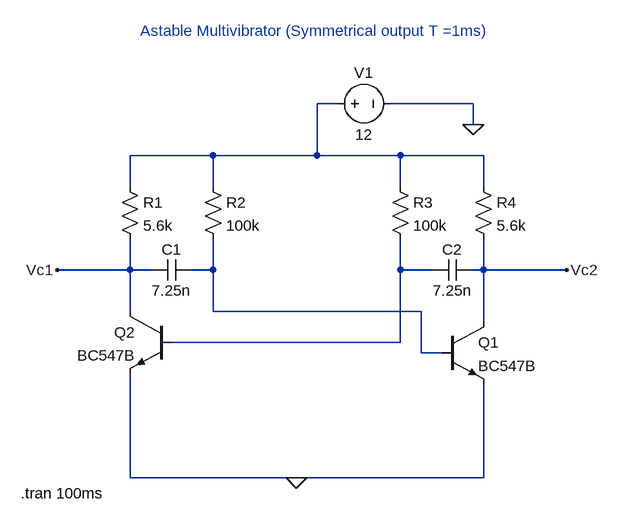
[diagram p0: schematic am1.asc]
am1.asc, the LTspice schematic file:
Version 4
SHEET 1 880 680
WIRE 400 -48 368 -48
WIRE 608 -48 480 -48
WIRE 608 -16 608 -48
WIRE 208 32 80 32
WIRE 368 32 368 -48
WIRE 368 32 208 32
WIRE 496 32 368 32
WIRE 624 32 496 32
WIRE 80 80 80 32
WIRE 208 80 208 32
WIRE 496 80 496 32
WIRE 624 80 624 32
WIRE 80 208 80 160
WIRE 80 208 -32 208
WIRE 112 208 80 208
WIRE 208 208 208 160
WIRE 208 208 176 208
WIRE 496 208 496 160
WIRE 544 208 496 208
WIRE 624 208 624 160
WIRE 624 208 608 208
WIRE 752 208 624 208
WIRE 80 272 80 208
WIRE 208 272 208 208
WIRE 528 272 208 272
WIRE 624 288 624 208
WIRE 496 320 496 208
WIRE 496 320 144 320
WIRE 528 336 528 272
WIRE 560 336 528 336
WIRE 80 528 80 368
WIRE 336 528 80 528
WIRE 624 528 624 384
WIRE 624 528 336 528
FLAG 336 528 0
FLAG -32 208 Vc1
FLAG 752 208 Vc2
FLAG 608 -16 0
SYMBOL res 64 64 R0
SYMATTR InstName R1
SYMATTR Value 5.6k
SYMBOL res 192 64 R0
SYMATTR InstName R2
SYMATTR Value 100k
SYMBOL res 480 64 R0
SYMATTR InstName R3
SYMATTR Value 100k
SYMBOL cap 176 192 R90
WINDOW 0 0 32 VBottom 2
WINDOW 3 32 32 VTop 2
SYMATTR InstName C1
SYMATTR Value 7.25n
SYMBOL res 608 64 R0
SYMATTR InstName R4
SYMATTR Value 5.6k
SYMBOL cap 608 192 R90
WINDOW 0 0 32 VBottom 2
WINDOW 3 32 32 VTop 2
SYMATTR InstName C2
SYMATTR Value 7.25n
SYMBOL npn 560 288 R0
SYMATTR InstName Q1
SYMATTR Value BC547B
SYMBOL npn 144 272 M0
SYMATTR InstName Q2
SYMATTR Value BC547B
SYMBOL voltage 384 -48 R270
WINDOW 0 32 56 VTop 2
WINDOW 3 -32 56 VBottom 2
WINDOW 123 0 0 Left 0
WINDOW 39 0 0 Left 0
SYMATTR InstName V1
SYMATTR Value 12
TEXT -88 552 Left 2 !.tran 100ms
TEXT 96 -160 Left 2 ;Astable Multivibrator (Symmetrical output T =1ms)

The netlist it stands for:
* am1.asc
R1 N001 Vc1 5.6k
R2 N001 N002 100k
R3 N001 N003 100k
C1 N002 Vc1 7.25n
R4 N001 Vc2 5.6k
C2 Vc2 N003 7.25n
Q1 Vc2 N002 0 0 BC547B
Q2 Vc1 N003 0 0 BC547B
V1 N001 0 12
.model NPN NPN
.model PNP PNP
.lib standard.bjt
.tran 100ms
* Astable Multivibrator (Symmetrical output T =1ms)
.backanno
.end